# Altium schematic sheet SHDN-BSPD-S10-V00-Connectivity.SchDoc: 8 Pin Connector
size A3; DrawnBy: Jonn Dillon; DocumentNumber: 10; Revision: 01; SheetNumber: 10; SheetTotal: 10
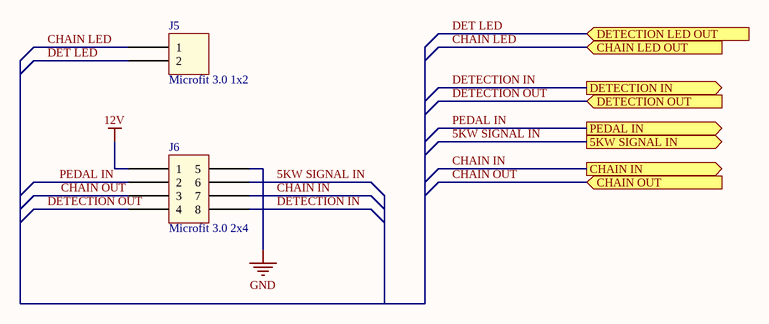
[diagram p0: SHDN-BSPD-S10-V00-Connectivity.SchDoc]

## Parts
J5  Microfit 3.0 1x2  [Microfit_1X2_R_TH]
J6  Microfit 3.0 2x4  [Microfit_2X4_R_TH]

## Ports
5KW SIGNAL IN (out), CHAIN IN (out), CHAIN LED OUT (in), CHAIN OUT (in), DETECTION IN (out), DETECTION LED OUT (in), DETECTION OUT (in), PEDAL IN (out)

## Nets
12V: J6.1
GND: J6.5
5KW SIGNAL IN: J6.6 ; port 5KW SIGNAL IN
CHAIN IN: J6.7 ; port CHAIN IN
CHAIN LED: J5.1 ; port CHAIN LED OUT
CHAIN OUT: J6.3 ; port CHAIN OUT
DET LED: J5.2 ; port DETECTION LED OUT
DETECTION IN: J6.8 ; port DETECTION IN
DETECTION OUT: J6.4 ; port DETECTION OUT
PEDAL IN: J6.2 ; port PEDAL IN

## Notes on the sheet
- Revision History:
- Sheet Title:
- Rev
- Date
- Description
- Project:
- Size:
- Drawn By:
- A3
- Number:
- Revision:
- Sheet
- Version:
- of
- QUT Motorsport
- O-120, Gardens Point
- 2 George Street
- Brisbane, QLD 4000
- Australia
- Print Date:
- Print Time:
- File Name:

## Library data of the parts
J5 = Microfit_1x2
J6 = Microfit_2x4